# Altium schematic sheet AnalogIO.SchDoc
size A4; SheetNumber: 5; SheetTotal: 10
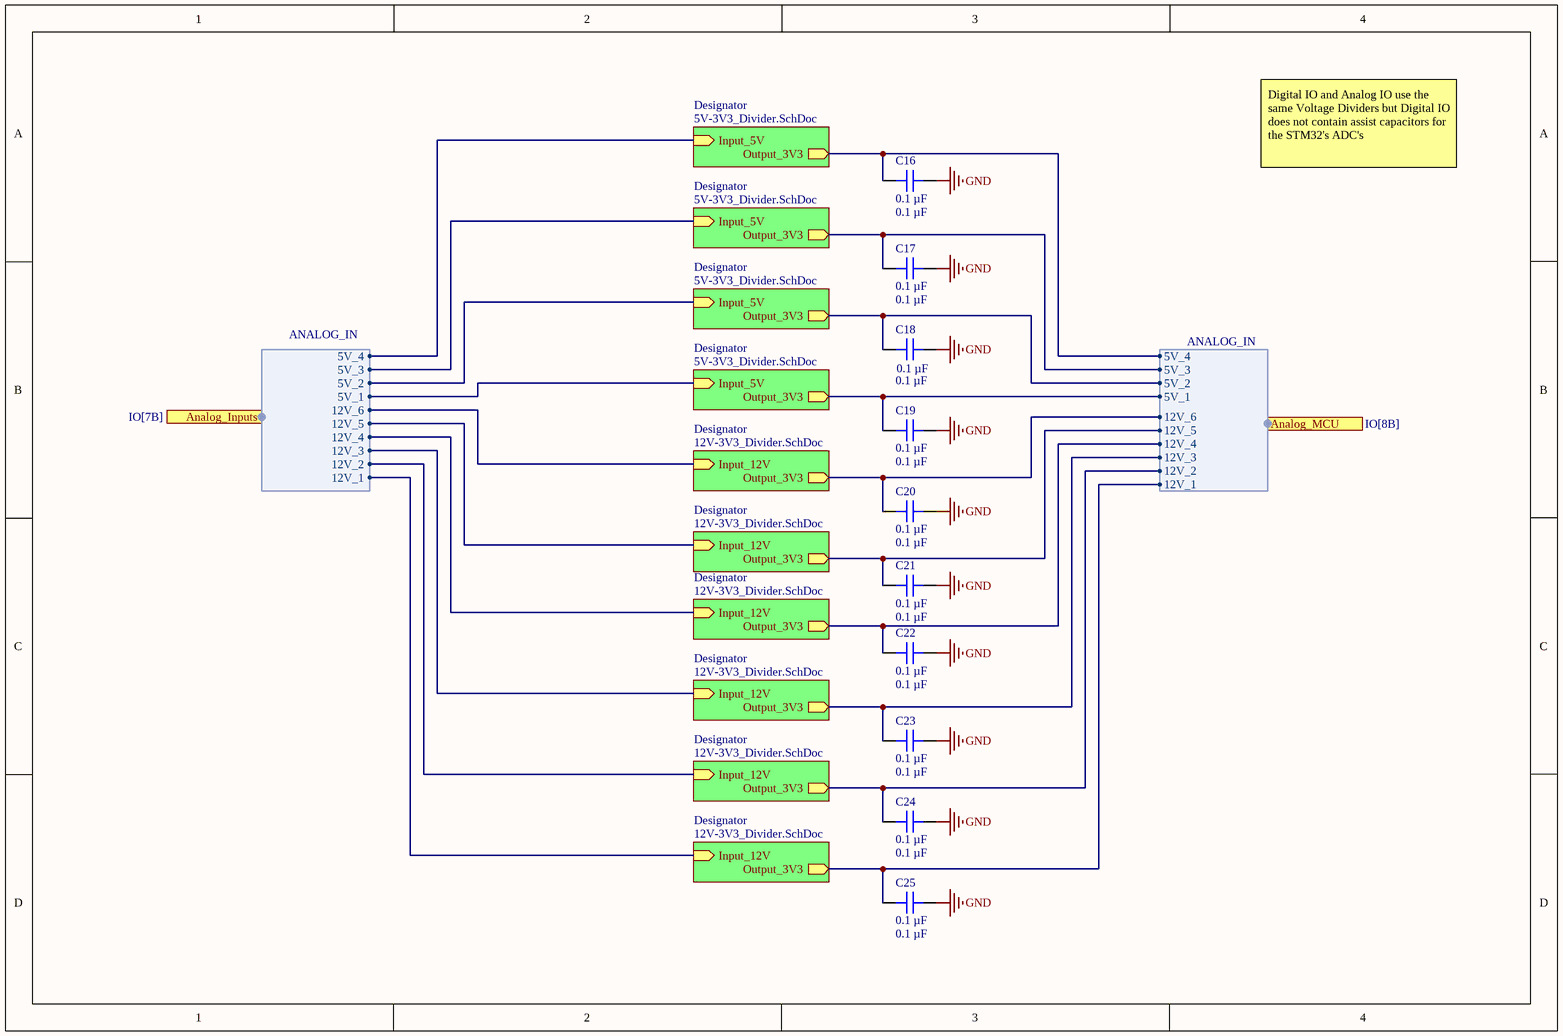
[diagram p0: AnalogIO.SchDoc]

## Parts
C16  0.1 µF  [CAP 0603_1608]
C17  0.1 µF  [CAP 0603_1608]
C18  0.1 µF  [CAP 0603_1608]
C19  0.1 µF  [CAP 0603_1608]
C20  0.1 µF  [CAP 0603_1608]
C21  0.1 µF  [CAP 0603_1608]
C22  0.1 µF  [CAP 0603_1608]
C23  0.1 µF  [CAP 0603_1608]
C24  0.1 µF  [CAP 0603_1608]
C25  0.1 µF  [CAP 0603_1608]

## Sub-sheets
Designator = 12V-3V3_Divider.SchDoc: Input_12V (in), Output_3V3 (out)
Designator = 12V-3V3_Divider.SchDoc: Input_12V (in), Output_3V3 (out)
Designator = 12V-3V3_Divider.SchDoc: Input_12V (in), Output_3V3 (out)
Designator = 12V-3V3_Divider.SchDoc: Input_12V (in), Output_3V3 (out)
Designator = 12V-3V3_Divider.SchDoc: Input_12V (in), Output_3V3 (out)
Designator = 12V-3V3_Divider.SchDoc: Input_12V (in), Output_3V3 (out)
Designator = 5V-3V3_Divider.SchDoc: Input_5V (in), Output_3V3 (out)
Designator = 5V-3V3_Divider.SchDoc: Input_5V (in), Output_3V3 (out)
Designator = 5V-3V3_Divider.SchDoc: Input_5V (in), Output_3V3 (out)
Designator = 5V-3V3_Divider.SchDoc: Input_5V (in), Output_3V3 (out)

## Ports
Analog_Inputs (harness ANALOG_IN, see IO[7B]), Analog_MCU (harness ANALOG_IN, see IO[8B])

## Harnesses
ANALOG_IN: 12V_1, 12V_2, 12V_3, 12V_4, 12V_5, 12V_6, 5V_1, 5V_2, 5V_3, 5V_4

## Nets
GND: C16.2 C17.2 C18.2 C19.2 C20.2 C21.2 C22.2 C23.2 C24.2 C25.2
NetC16_1: C16.1 ; sheet Designator/Output_3V3, port Analog_MCU.5V_4
NetC17_1: C17.1 ; sheet Designator/Output_3V3, port Analog_MCU.5V_3
NetC18_1: C18.1 ; sheet Designator/Output_3V3, port Analog_MCU.5V_2
NetC19_1: C19.1 ; sheet Designator/Output_3V3, port Analog_MCU.5V_1
NetC20_1: C20.1 ; sheet Designator/Output_3V3, port Analog_MCU.12V_6
NetC21_1: C21.1 ; sheet Designator/Output_3V3, port Analog_MCU.12V_5
NetC22_1: C22.1 ; sheet Designator/Output_3V3, port Analog_MCU.12V_4
NetC23_1: C23.1 ; sheet Designator/Output_3V3, port Analog_MCU.12V_3
NetC24_1: C24.1 ; sheet Designator/Output_3V3, port Analog_MCU.12V_2
NetC25_1: C25.1 ; sheet Designator/Output_3V3, port Analog_MCU.12V_1
(unnamed): sheet Designator/Input_12V, port Analog_Inputs.12V_6
(unnamed): sheet Designator/Input_12V, port Analog_Inputs.12V_1
(unnamed): sheet Designator/Input_12V, port Analog_Inputs.12V_2
(unnamed): sheet Designator/Input_12V, port Analog_Inputs.12V_3
(unnamed): sheet Designator/Input_12V, port Analog_Inputs.12V_4
(unnamed): sheet Designator/Input_12V, port Analog_Inputs.12V_5
(unnamed): sheet Designator/Input_5V, port Analog_Inputs.5V_1
(unnamed): sheet Designator/Input_5V, port Analog_Inputs.5V_2
(unnamed): sheet Designator/Input_5V, port Analog_Inputs.5V_3
(unnamed): sheet Designator/Input_5V, port Analog_Inputs.5V_4

## Notes on the sheet
- Digital IO and Analog IO use the same Voltage Dividers but Digital IO does not contain assist capacitors for the STM32's ADC's

## Library data of the parts
C16-C25 = CS0603KRX7R7BB104: CAP CER 0.1UF 16V X7R 0603; Part Number: CS0603KRX7R7BB104; Value: 0.1 µF